# Altium schematic sheet pt100.SchDoc
size A4
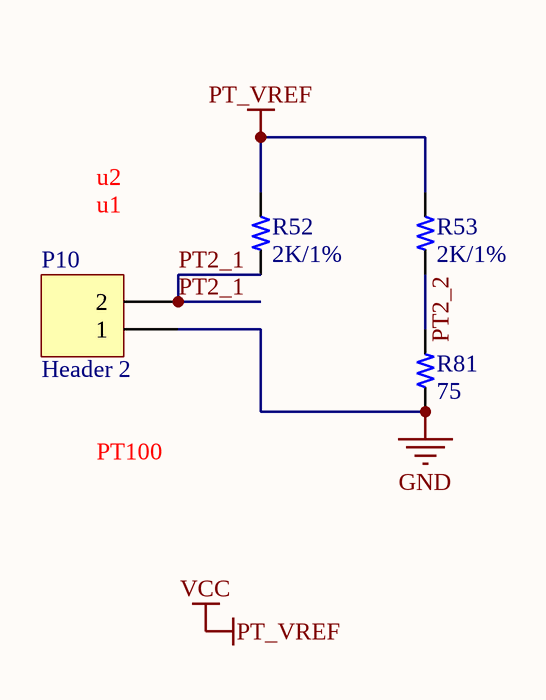
[diagram p0: pt100.SchDoc]

## Parts
P10  Header 2  [KF250NH-3.5-2P]
R52  2K/1%  [0603R]
R53  2K/1%  [0603R]
R81  75  [0603R]

## Nets
GND: P10.1 R81.1
PT_VREF: R52.2 R53.2  [also labelled VCC]
PT2_1: P10.2 R52.1
PT2_2: R53.1 R81.2

## Notes on the sheet
- (near P10) u1
- u2
- PT100

## Library data of the parts
R52 R53 R81 = R
  R52 R53: Value: 2K/1%
  R81: Value: 75
P10 = Header 2: Publisher: Altium Limited; Value: Header 2